# Altium schematic sheet ADC.SchDoc: ClickBoard - ADC
size Letter; ApprovedBy: K.C.; Author: Antoine Perron; Organization: Cegep Limoilou; Address1: 1300, 8e Avenue; Address2: Québec, QC; Address3: Canada; Address4: G1J 5L5; Revision: B3; SheetNumber: 3; SheetTotal: 5
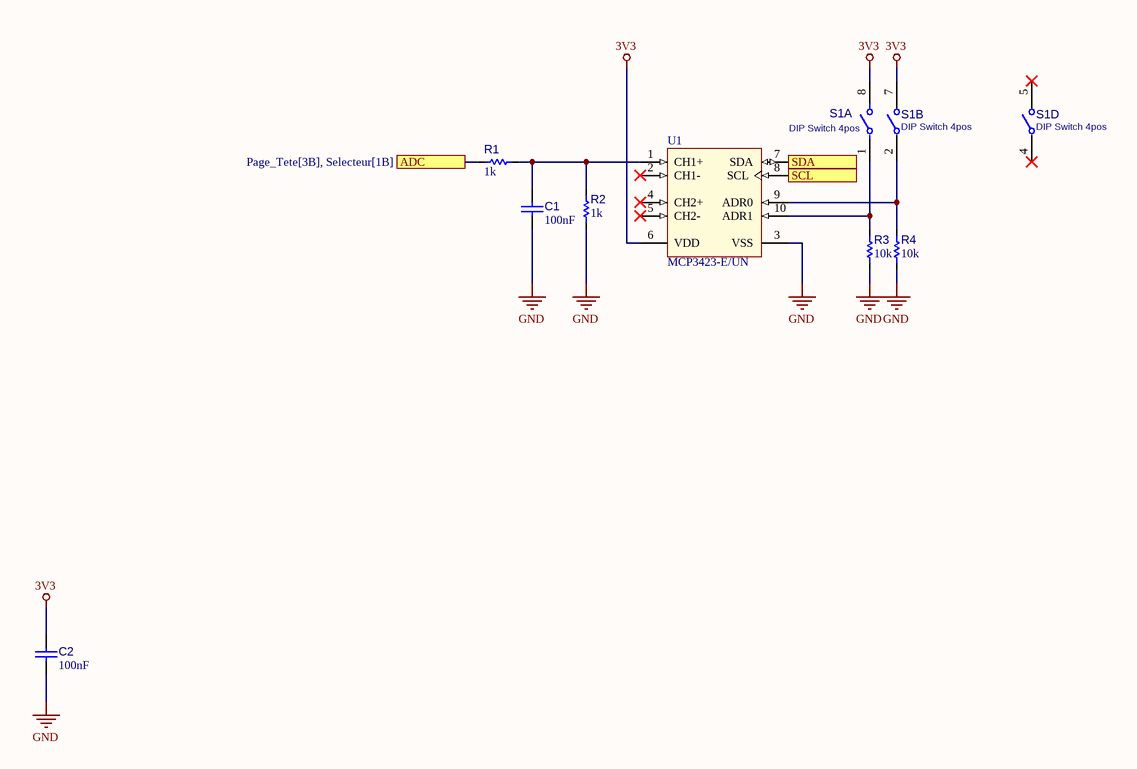
[diagram p0: ADC.SchDoc]

## Parts
C1  value 100nF  [C_1608[0603]]  (hidden comment: CAP CER 100nF 50V 0603)
C2  value 100nF  [C_1608[0603]]  (hidden comment: CAP CER 100nF 50V 0603)
R1  value 1k  [R_1608[0603]]  (hidden comment: Res 1k 1% 0603)
R2  value 1k  [R_1608[0603]]  (hidden comment: Res 1k 1% 0603)
R3  value 10k  [R_1608[0603]]  (hidden comment: Res 10k 1% 0603)
R4  value 10k  [R_1608[0603]]  (hidden comment: Res 10k 1% 0603)
S1  value DIP Switch 4pos  [S_DIP_SWITCH_50MIL_4POS]  (hidden comment: DSHP04TSGER)  (parts A,B,D of 4)
U1  MCP3423-E/UN  [U_MSOP50P300X500-10(RM-10)_WO-TP]

## Ports
ADC (see Page_Tete[3B], Selecteur[1B]), SCL (see Page_Tete[3B], Alimentation[4B], IOexpander[2B]), SDA (see Page_Tete[3B], Alimentation[4B], IOexpander[2B])

## Nets
3V3: C2.2 S1.7 S1.8 U1.6(VDD)
GND: C1.1 C2.1 R2.1 R3.1 R4.1 U1.3(VSS)
ADC: R1.1 ; port ADC
SCL: U1.8(SCL) ; port SCL
SDA: U1.7(SDA) ; port SDA
NetC1_2: C1.2 R1.2 R2.2 U1.1(CH1+)
NetR3_2: R3.2 S1.1 U1.10(ADR1)
NetR4_2: R4.2 S1.2 U1.9(ADR0)

Not connected (* = marked no-connect by the designer): S1 4* 5*; U1 2(CH1-)* 4(CH2+)* 5(CH2-)*

## Notes on the sheet
- Titre :
- Conception :
- Date :
- Approbation :
- Heure :
- Révision :
- Feuille
- de
- Fichier :

## Library data of the parts
C1 C2 = CAP002: Capacitor type 1; Manufacturer 1: Yageo; Manufacturer Part Number 1: CC0603KRX7R9BB104; LibRef: CAP002; Code CEGEP: COND0143SM; Tolerance: 10%; Dielectric: X7R; Rated Voltage: 50V; Mounting Technology: SMT; Supplier 1: LCSC; Supplier Part Number 1: C14663
R1 R2 = RES015: Resistor type 1; Manufacturer 1: Yageo; Manufacturer Part Number 1: RC0603FR-071KL; LibRef: RES015; Puissance: 1/10W; Max Working Voltage: 75V; Tolerance: 1%; Mounting Technology: SMT; Supplier 1: LCSC; Supplier Part Number 1: C22548
R3 R4 = RES001: Resistor type 1; Manufacturer 1: Yageo; Manufacturer Part Number 1: RC0603FR-0710KL; LibRef: RES001; Code CEGEP: RESI0238-0603; Puissance: 1/10W; Max Working Voltage: 75V; Tolerance: 1%; Mounting Technology: SMT; Supplier 1: LCSC; Supplier Part Number 1: C98220
S1 = SW_DIP_50MIL_4POS: SWITCH DIP SLIDE SPST 25MA 24V, pitch 1.27mm, height 1.55mm; Manufacturer 1: kangshen; Manufacturer 2: Omron; Manufacturer Part Number 1: DSHP04TSGER; Manufacturer Part Number 2: A6H-4102-PM; Mounting Technology: SMT; Supplier 1: LCSC; Supplier 2: LCSC; Supplier Part Number 1: C3293144; Supplier Part Number 2: C2733274; Supplier 3: Digikey; Supplier Part Number 3: 39-A6H-4102-PMCT-ND
U1 = U_MCP3423-E/UN: CAN Controller Stand-Alone With SPI, 18-Pin PDIP; Manufacturer 1: Microchip; Manufacturer Part Number 1: MCP3423-E/UN; Supplier 1: LCSC; Supplier Part Number 1: C220864; Mounting Technology: SMT; Supplier 2: Digikey; Supplier Part Number 2: MCP3423-E/UN-ND